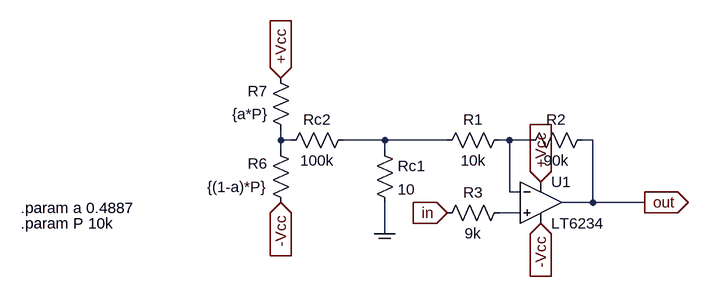
[diagram p0: schematic amp-neinv-comp-DC-symb.asc]
amp-neinv-comp-DC-symb.asc, the LTspice schematic file:
Version 4
SHEET 1 1580 680
WIRE -176 48 -176 32
WIRE -160 48 -176 48
WIRE -16 48 -80 48
WIRE 80 48 -16 48
WIRE 176 48 160 48
WIRE 208 48 176 48
WIRE 304 48 288 48
WIRE -176 64 -176 48
WIRE -16 64 -16 48
WIRE 176 128 176 48
WIRE 192 128 176 128
WIRE 304 144 304 48
WIRE 304 144 256 144
WIRE 384 144 304 144
WIRE 192 160 160 160
WIRE -16 192 -16 144
FLAG -176 -48 +Vcc
IOPIN -176 -48 In
FLAG 224 112 +Vcc
IOPIN 224 112 In
FLAG 224 176 -Vcc
IOPIN 224 176 In
FLAG -176 144 -Vcc
IOPIN -176 144 In
FLAG 80 160 in
IOPIN 80 160 In
FLAG 384 144 out
IOPIN 384 144 Out
FLAG -16 192 COM
IOPIN -16 192 In
SYMBOL OpAmps\\LT6234 224 144 R0
SYMATTR InstName U1
SYMBOL res 176 144 R90
WINDOW 0 0 56 VBottom 2
WINDOW 3 32 56 VTop 2
SYMATTR InstName R3
SYMATTR Value 9k
SYMBOL res 304 32 R90
WINDOW 0 0 56 VBottom 2
WINDOW 3 32 56 VTop 2
SYMATTR InstName R2
SYMATTR Value 90k
SYMBOL res 176 32 R90
WINDOW 0 0 56 VBottom 2
WINDOW 3 32 56 VTop 2
SYMATTR InstName R1
SYMATTR Value 10k
SYMBOL res -32 48 R0
SYMATTR InstName Rc1
SYMATTR Value 10
SYMBOL res -64 32 R90
WINDOW 0 0 56 VBottom 2
WINDOW 3 32 56 VTop 2
SYMATTR InstName Rc2
SYMATTR Value 100k
SYMBOL res -160 160 R180
WINDOW 0 36 76 Left 2
WINDOW 3 36 40 Left 2
SYMATTR InstName R6
SYMATTR Value {(1-a)*P}
SYMBOL res -160 48 R180
WINDOW 0 36 76 Left 2
WINDOW 3 36 40 Left 2
SYMATTR InstName R7
SYMATTR Value {a*P}
TEXT -576 176 Left 2 !.param P 10k
TEXT -576 152 Left 2 !.param a 0.4887

The netlist it stands for:
* amp-neinv-comp-DC-symb.asc
* U1: LT6234 (symbol OpAmps\LT6234 not available, pins judged from their places): In+=N004 In-=N003 V+=+Vcc V-=-Vcc OUT=out
R3 N004 in 9k
R2 out N003 90k
R1 N003 N002 10k
Rc1 N002 COM 10
Rc2 N002 N001 100k
R6 -Vcc N001 {(1-a)*P}
R7 N001 +Vcc {a*P}
.param P 10k
.param a 0.4887
.backanno
.end